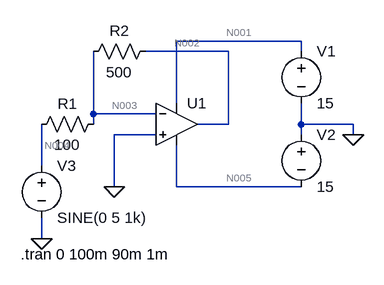
[diagram p0: schematic Inverting Non inverting.asc]
Inverting Non inverting.asc, the LTspice schematic file:
Version 4
SHEET 1 880 680
WIRE 384 32 192 32
WIRE 272 48 144 48
WIRE 384 48 384 32
WIRE 192 128 192 32
WIRE 64 144 64 48
WIRE 160 144 64 144
WIRE 64 160 64 144
WIRE 272 160 272 48
WIRE 272 160 224 160
WIRE 384 160 384 128
WIRE 464 160 384 160
WIRE 160 176 96 176
WIRE 384 176 384 160
WIRE 464 176 464 160
WIRE -16 224 -16 160
WIRE 96 256 96 176
WIRE 192 256 192 192
WIRE 384 256 192 256
WIRE -16 336 -16 304
FLAG 464 176 0
FLAG 96 256 0
FLAG -16 336 0
SYMBOL res 80 144 R90
WINDOW 0 0 56 VBottom 2
WINDOW 3 32 56 VTop 2
SYMATTR InstName R1
SYMATTR Value 100
SYMBOL res 160 32 R90
WINDOW 0 0 56 VBottom 2
WINDOW 3 32 56 VTop 2
SYMATTR InstName R2
SYMATTR Value 500
SYMBOL voltage 384 32 R0
SYMATTR InstName V1
SYMATTR Value 15
SYMBOL voltage 384 160 R0
SYMATTR InstName V2
SYMATTR Value 15
SYMBOL voltage -16 208 R0
WINDOW 123 0 0 Left 0
WINDOW 39 0 0 Left 0
SYMATTR InstName V3
SYMATTR Value SINE(0 5 1k)
SYMBOL OpAmps\\UniversalOpAmp 192 160 R0
SYMATTR InstName U1
TEXT -48 360 Left 2 !.tran 0 100m 90m 1m

The netlist it stands for:
* Inverting Non inverting.asc
R1 N003 N004 100
R2 N002 N003 500
V1 N001 0 15
V2 0 N005 15
V3 N004 0 SINE(0 5 1k)
XU1 0 N003 N001 N005 N002 level1 Avol=1Meg GBW=10Meg Vos=0 En=0 Enk=0 In=0 Ink=0 Rin=500Meg  ; pins In+ In- V+ V- OUT
.tran 0 100m 90m 1m
.lib UniversalOpAmp1.lib
.backanno
.end

* Results of the author's LTspice run, read from the files saved beside the schematic
* Operating Point, zero values left out:
*   V(n001) = 15 V
*   V(n005) = -15 V
*   I(V1) = -30 nA
*   I(V2) = -30 nA
*   Ix(u1:3) = 30 nA
*   Ix(u1:4) = -30 nA
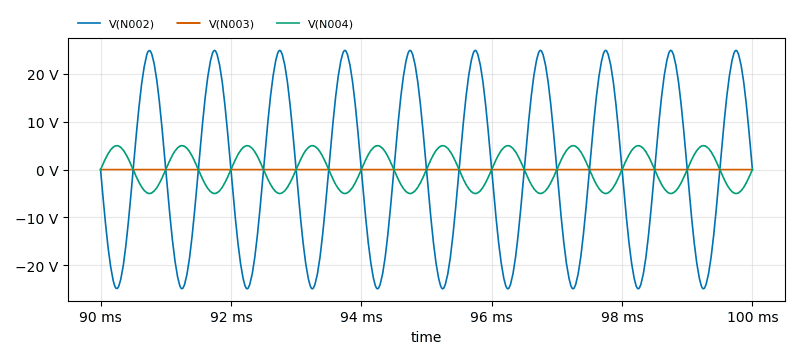
[diagram p1: Transient Analysis of Inverting Non inverting.asc, plotted from the saved traces]
* Transient Analysis, 1 run:
*   V(N002): min -24.94 V, max 24.94 V, average -293.1 µV, rms 17.51 V, last 14.94 mV
*   V(N003): min -2.471 mV, max 2.49 mV, average 92.15 nV, rms 1.747 mV, last 2.49 mV
*   V(N004): min -5 V, max 5 V, average 24.35 µV, rms 3.54 V, last 0 V